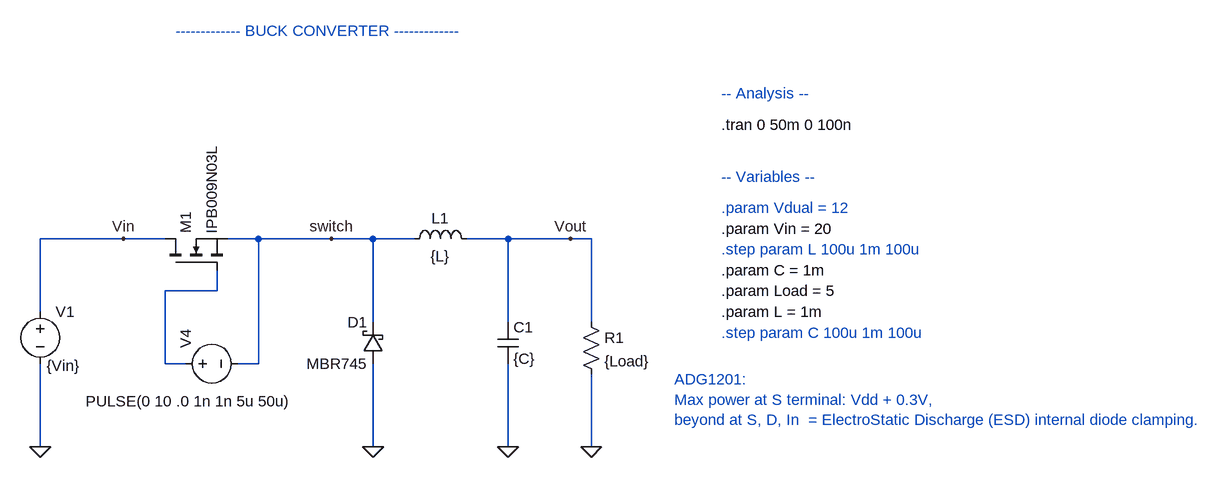
[diagram p0: schematic Buck Converter.asc]
Buck Converter.asc, the LTspice schematic file:
Version 4.1
SHEET 1 2036 680
WIRE -160 80 -288 80
WIRE -96 80 -160 80
WIRE 48 80 0 80
WIRE 160 80 48 80
WIRE 224 80 160 80
WIRE 288 80 224 80
WIRE 432 80 368 80
WIRE 528 80 432 80
WIRE 560 80 528 80
WIRE -16 160 -16 128
WIRE -16 160 -96 160
WIRE -288 192 -288 80
WIRE 224 208 224 80
WIRE 432 208 432 80
WIRE 560 208 560 80
WIRE -96 272 -96 160
WIRE -64 272 -96 272
WIRE 48 272 48 80
WIRE 48 272 16 272
WIRE -288 400 -288 272
WIRE 224 400 224 272
WIRE 432 400 432 272
WIRE 560 400 560 288
FLAG 528 80 Vout
FLAG 160 80 switch
FLAG -160 80 Vin
FLAG -288 400 0
FLAG 224 400 0
FLAG 432 400 0
FLAG 560 400 0
SYMBOL voltage -288 176 R0
WINDOW 3 10 99 Left 2
WINDOW 123 0 0 Left 0
WINDOW 39 0 0 Left 0
SYMATTR Value {Vin}
SYMATTR InstName V1
SYMBOL ind 272 96 R270
WINDOW 0 32 56 VTop 2
WINDOW 3 5 56 VBottom 2
SYMATTR InstName L1
SYMATTR Value {L}
SYMATTR SpiceLine Rser=1m
SYMBOL cap 416 208 R0
SYMATTR InstName C1
SYMATTR Value {C}
SYMBOL res 544 192 R0
SYMATTR InstName R1
SYMATTR Value {Load}
SYMBOL schottky 240 272 R180
WINDOW 0 24 64 Left 2
WINDOW 3 24 0 Left 2
SYMATTR InstName D1
SYMATTR Value MBR745
SYMATTR Description Diode
SYMATTR Type diode
SYMBOL voltage -80 272 R270
WINDOW 123 0 0 Left 0
WINDOW 39 0 0 Left 0
WINDOW 3 -58 -138 VRight 2
SYMATTR Value PULSE(0 10 .0 1n 1n 5u 50u)
SYMATTR InstName V4
SYMBOL nmos -96 128 R270
SYMATTR InstName M1
SYMATTR Value IPB009N03L
TEXT -80 -240 Left 2 ;------------- BUCK CONVERTER -------------
TEXT 760 32 Left 2 ;.param Vdual = 12
TEXT 760 -96 Left 2 !.tran 0 50m 0 100n
TEXT 760 96 Left 2 ;.step param L 100u 1m 100u
TEXT 760 128 Left 2 !.param C = 1m
TEXT 760 160 Left 2 !.param Load = 5
TEXT 760 -144 Left 2 ;-- Analysis --
TEXT 760 -16 Left 2 ;-- Variables --
TEXT 760 64 Left 2 !.param Vin = 20
TEXT 688 296 Left 2 ;ADG1201:\nMax power at S terminal: Vdd + 0.3V, \nbeyond at S, D, In  = ElectroStatic Discharge (ESD) internal diode clamping.
TEXT 760 192 Left 2 !.param L = 1m
TEXT 760 224 Left 2 ;.step param C 100u 1m 100u

The netlist it stands for:
* Buck Converter.asc
V1 Vin 0 {Vin}
L1 switch Vout {L} Rser=1m
C1 Vout 0 {C}
R1 Vout 0 {Load}
D1 0 switch MBR745
V4 N001 switch PULSE(0 10 .0 1n 1n 5u 50u)
M1 Vin N001 switch switch IPB009N03L
.model D D
.lib standard.dio
.model NMOS NMOS
.model PMOS PMOS
.lib standard.mos
* ------------- BUCK CONVERTER -------------
* .param Vdual = 12
.tran 0 50m 0 100n
* .step param L 100u 1m 100u
.param C = 1m
.param Load = 5
* -- Analysis --
* -- Variables --
.param Vin = 20
* ADG1201:
* Max power at S terminal: Vdd + 0.3V,
* beyond at S, D, In  = ElectroStatic Discharge (ESD) internal diode clamping.
.param L = 1m
* .step param C 100u 1m 100u
.backanno
.end